# EAGLE schematic pclone-control (EAGLE 6.6.0)
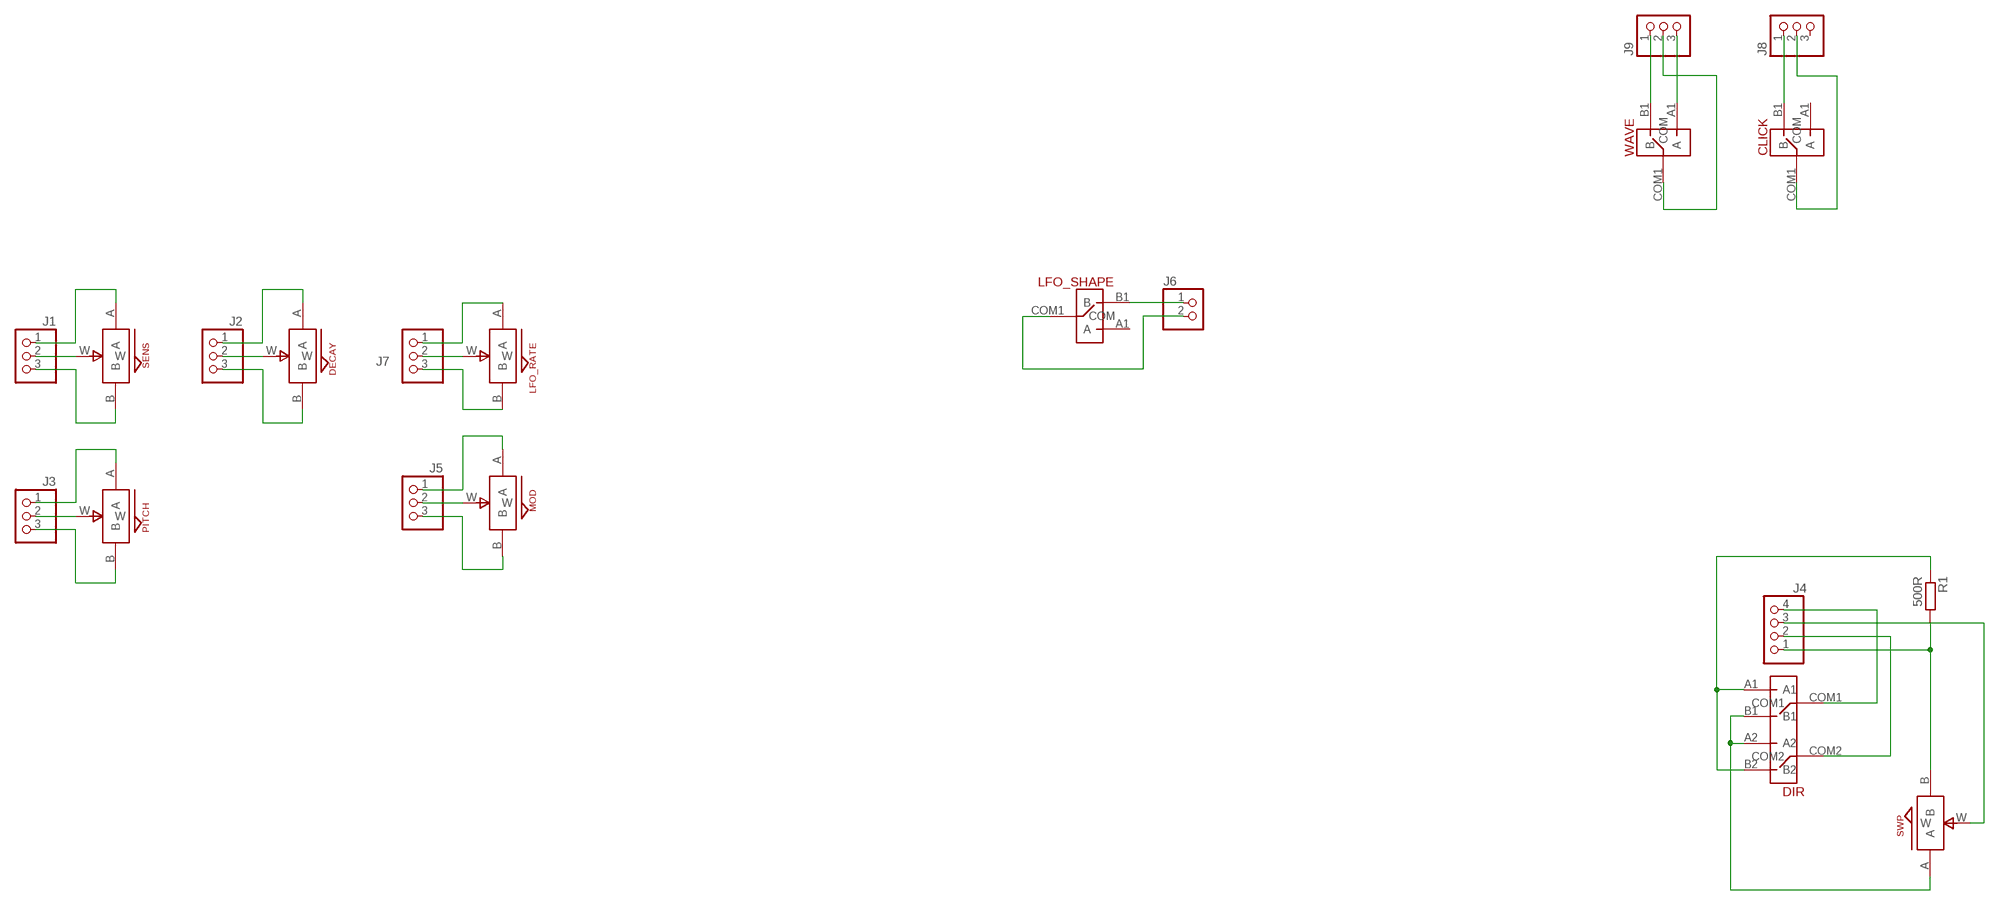
[diagram p0: schematic, sheet 1]

## Parts
CLICK  SPDT_SW  [SPDT_SW]
DECAY  ALPS_POT_SMALL  [SMALL_ALPS_POT]
DIR  DPDT_SW  [DPDT_SW]
J1  PINHD-1X3  [1X03]
J2  PINHD-1X3  [1X03]
J3  PINHD-1X3  [1X03]
J4  PINHD-1X4  [1X04]
J5  PINHD-1X3  [1X03]
J6  PINHD-1X2  [1X02]
J7  PINHD-1X3  [1X03]
J8  PINHD-1X3  [1X03]
J9  PINHD-1X3  [1X03]
LFO_RATE  ALPS_POT_SMALL  [SMALL_ALPS_POT]
LFO_SHAPE  SPDT_SW  [SPDT_SW]
MOD  ALPS_POT_SMALL  [SMALL_ALPS_POT]
PITCH  ALPS_POT_SMALL  [SMALL_ALPS_POT]
R1  500R  R-EU_0207/7  [0207/7]
SENS  ALPS_POT_SMALL  [SMALL_ALPS_POT]
SWP  ALPS_POT_SMALL  [SMALL_ALPS_POT]
WAVE  SPDT_SW  [SPDT_SW]

## Nets
GND: J1.1 SENS.A
N$1: J4.1 R1.2 SWP.B
N$2: DIR.A1 DIR.B2 R1.1
N$3: DIR.A2 DIR.B1 SWP.A
N$4: DIR.COM1 J4.4
N$5: DIR.COM2 J4.2
N$6: J4.3 SWP.W
N$7: J9.1 WAVE.B1(B)
N$8: J9.3 WAVE.A1(A)
N$9: J9.2 WAVE.COM1(COM)
N$10: CLICK.B1(B) J8.1
N$11: CLICK.COM1(COM) J8.2
N$12: J6.1 LFO_SHAPE.B1(B)
N$13: J6.2 LFO_SHAPE.COM1(COM)
N$14: J1.2 SENS.W
N$16: J1.3 SENS.B
N$17: DECAY.W J2.2
N$18: DECAY.A J2.1
N$19: DECAY.B J2.3
N$20: J5.2 MOD.W
N$21: J5.1 MOD.A
N$22: J5.3 MOD.B
N$23: J3.2 PITCH.W
N$24: J3.1 PITCH.A
N$25: J3.3 PITCH.B
N$26: J7.2 LFO_RATE.W
N$27: J7.3 LFO_RATE.B
N$28: J7.1 LFO_RATE.A
Unconnected: CLICK.A1(A) J8.3 LFO_SHAPE.A1(A)

## Library data of the parts
CLICK LFO_SHAPE WAVE = jason_eagle6:SPDT_SW
DECAY LFO_RATE MOD PITCH SENS SWP = jasons_stuff:ALPS_POT_SMALL
DIR = jason_eagle6:DPDT_SW
J1-J3 J5 J7-J9 = pinhead:PINHD-1X3: PIN HEADER
J4 = pinhead:PINHD-1X4: PIN HEADER
J6 = pinhead:PINHD-1X2: PIN HEADER
R1 = rcl:R-EU_: RESISTOR, European symbol